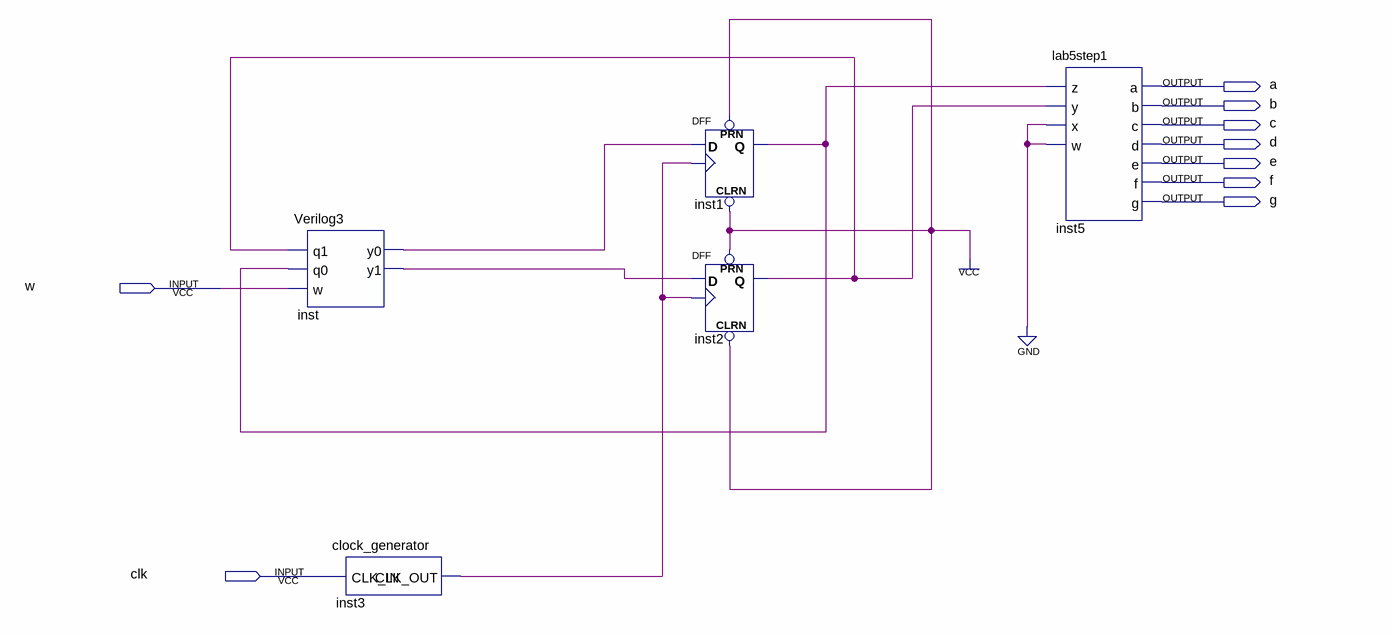
[diagram p0: schematic sheet]
// Quartus schematic lab11step3.bdf as structural Verilog: 5 symbols, 9 pins
module lab11step3 (
  input  w,
  input  clk,
  output a,
  output b,
  output c,
  output d,
  output e,
  output f,
  output g
);

  wire inst1_q, inst2_q, inst3_clk_out, inst_y0, inst_y1;

  Verilog3 inst (.q1(inst2_q), .q0(inst1_q), .w(w), .y0(inst_y0), .y1(inst_y1));
  clock_generator inst3 (.CLK_IN(clk), .CLK_OUT(inst3_clk_out));
  DFF inst1 (.CLRN(1'b1), .CLK(inst3_clk_out), .D(inst_y0), .PRN(1'b1), .Q(inst1_q));
  DFF inst2 (.CLRN(1'b1), .CLK(inst3_clk_out), .D(inst_y1), .PRN(1'b1), .Q(inst2_q));
  lab5step1 inst5 (.z(inst1_q), .x(1'b0), .w(1'b0), .y(inst2_q), .a(a), .b(b), .c(c), .d(d), .e(e), .f(f), .g(g));
endmodule
